# EAGLE design stereo amp 1562Q (EAGLE 5.07)
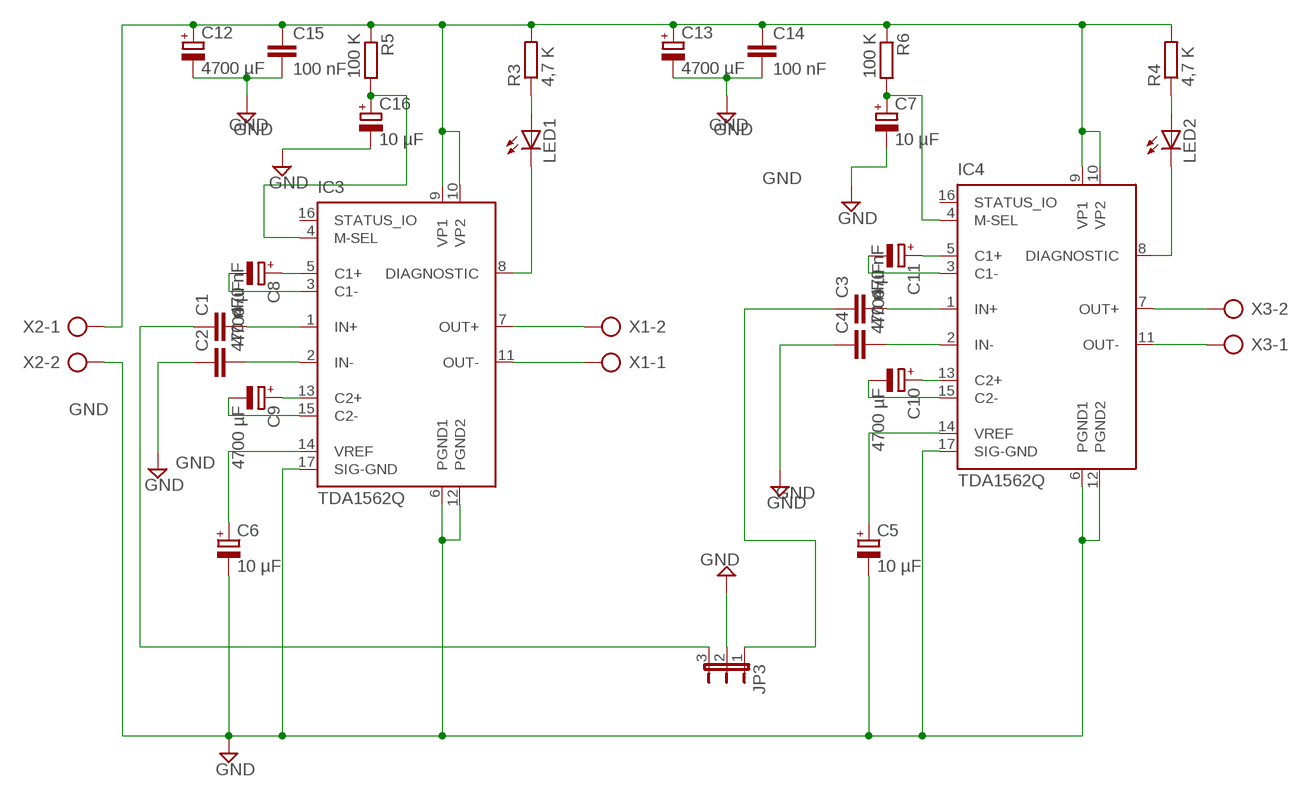
[diagram p0: schematic, sheet 1]

## Parts
C1  470 nF  C5/5  [C5B5]
C2  470 nF  C5/5  [C5B5]
C3  470 nF  C5/5  [C5B5]
C4  470 nF  C5/5  [C5B5]
C5  10 µF  CPOL-EUE2.5-6  [E2,5-6]
C6  10 µF  CPOL-EUE2.5-6  [E2,5-6]
C7  10 µF  CPOL-EUE2.5-6  [E2,5-6]
C8  4700 µF  CPOL-EUE7.5-18  [E7,5-18]
C9  4700 µF  CPOL-EUE7.5-18  [E7,5-18]
C10  4700 µF  CPOL-EUE7.5-18  [E7,5-18]
C11  4700 µF  CPOL-EUE7.5-18  [E7,5-18]
C12  4700 µF  CPOL-EUE7.5-18  [E7,5-18]
C13  4700 µF  CPOL-EUE7.5-18  [E7,5-18]
C14  100 nF  C-EU050-030X075  [C050-030X075]
C15  100 nF  C-EU050-030X075  [C050-030X075]
C16  10 µF  CPOL-EUE2.5-6  [E2,5-6]
IC3  TDA1562Q  [MULTIWAT-SIL17]
IC4  TDA1562Q  [MULTIWAT-SIL17]
JP3  JP2E  [JP2]
LED1  LED3MM  [LED3MM]
LED2  LED3MM  [LED3MM]
R3  4,7 K  R-EU_0204/7  [0204/7]
R4  4,7 K  R-EU_0204/7  [0204/7]
R5  100 K  R-EU_0204/7  [0204/7]
R6  100 K  R-EU_0204/7  [0204/7]
X1  AK300/2  [AK300/2]
X2  AK300/2  [AK300/2]
X3  AK300/2  [AK300/2]

## Nets
GND: C2.1 C4.1 C5.- C6.- C7.- C12.- C13.- C14.2 C15.2 C16.- IC3.6(PGND1) IC3.12(PGND2) IC3.17(SIG-GND) IC4.6(PGND1) IC4.12(PGND2) IC4.17(SIG-GND) JP3.2 X2.2
N$1: C8.+ IC3.5(C1+)
N$2: C10.+ IC4.13(C2+)
N$3: C11.+ IC4.5(C1+)
N$4: C9.+ IC3.13(C2+)
N$5: C3.2 IC4.1(IN+)
N$6: LED1.A R3.1
N$7: C8.- IC3.3(C1-)
N$8: C9.- IC3.15(C2-)
N$9: LED2.A R4.1
N$10: IC3.7(OUT+) X1.2
N$11: C1.2 IC3.1(IN+)
N$12: C2.2 IC3.2(IN-)
N$13: C4.2 IC4.2(IN-)
N$14: C6.+ IC3.14(VREF)
N$15: C7.+ IC4.4(M-SEL) R6.2
N$16: C11.- IC4.3(C1-)
N$17: C3.1 JP3.1
N$18: C10.- IC4.15(C2-)
N$20: IC4.8(DIAGNOSTIC) LED2.K(C)
N$22: IC3.11(OUT-) X1.1
N$23: IC4.11(OUT-) X3.1
N$24: IC3.8(DIAGNOSTIC) LED1.K(C)
N$25: C1.1 JP3.3
N$26: C5.+ IC4.14(VREF)
N$27: IC4.7(OUT+) X3.2
N$30: C16.+ IC3.4(M-SEL) R5.2
N$32: C12.+ C13.+ C14.1 C15.1 IC3.9(VP1) IC3.10(VP2) IC4.9(VP1) IC4.10(VP2) R3.2 R4.2 R5.1 R6.1 X2.1
Unconnected: IC3.16(STATUS_IO) IC4.16(STATUS_IO)

## Library data of the parts
C1-C4 = capacitor-wima:C: CAPACITOR naming: grid - package width
C5-C13 C16 = rcl:CPOL-EU: POLARIZED CAPACITOR, European symbol
C14 C15 = rcl:C-EU: CAPACITOR, European symbol
IC3 IC4 = linear:TDA1562: 70 W High Efficiency Power Amplifier with diagnostic facility
JP3 = jumper:JP2E: JUMPER
LED1 LED2 = led:LED: LED OSRAM: - CHIPLED LG R971, LG N971, LY N971, LG Q971, LY Q971, LO R971, LY R971 LH N974, LH R974 LS Q976, LO Q976, LY Q976 LO Q996 - Hyper CHIPLED LW Q18S LB Q993, LB Q99A, LB R99A - SideLED LS A670, LO A670, LY A670, LG A670, LP A670 LB A673, LV A673, LT A673, LW A673 LH A674 LY A675 LS A676, LA A676, LO A676, LY A676, LW A676 LS A679, LY A679, LG A679 - Hyper Micro SIDELED® LS Y876, LA Y876, LO Y876, LY Y876 LT Y87S - SmartLED LW L88C, LW L88S LB L89C, LB L89S, LG L890 LS L89K, LO L89K, LY L89K LS L896, LA L896, LO L896, LY L896 - TOPLED LS T670, LO T670, LY T670, LG T670, LP T670 LSG T670, LSP T670, LSY T670, LOP T670, LYG T670 LG T671, LOG T671, LSG T671 LB T673, LV T673, LT T673, LW T673 LH T674 LS T676, LA T676, LO T676, LY T676, LB T676, LH T676, LSB T676, LW T676 LB T67C, LV T67C, LT T67C, LS T67K, LO T67K, LY T67K, LW E67C LS E67B, LA E67B, LO E67B, LY E67B, LB E67C, LV E67C, LT E67C LW T67C LS T679, LY T679, LG T679 LS T770, LO T770, LY T770, LG T770, LP T770 LB T773, LV T773, LT T773, LW T773 LH T774 LS E675, LA E675, LY E675, LS T675 LS T776, LA T776, LO T776, LY T776, LB T776 LHGB T686 LT T68C, LB T68C - Hyper Mini TOPLED® LB M676 - Mini TOPLED Santana® LG M470 LS M47K, LO M47K, LY M47K Source: http://www.osram.convergy.de LUXEON: - LUMILED® LXK2-PW12-R00, LXK2-PW12-S00, LXK2-PW14-U00, LXK2-PW14-V00 LXK2-PM12-R00, LXK2-PM12-S00, LXK2-PM14-U00 LXK2-PE12-Q00, LXK2-PE12-R00, LXK2-PE12-S00, LXK2-PE14-T00, LXK2-PE14-U00 LXK2-PB12-K00, LXK2-PB12-L00, LXK2-PB12-M00, LXK2-PB14-N00, LXK2-PB14-P00, LXK2-PB14-Q00 LXK2-PR12-L00, LXK2-PR12-M00, LXK2-PR14-Q00, LXK2-PR14-R00 LXK2-PD12-Q00, LXK2-PD12-R00, LXK2-PD12-S00 LXK2-PH12-R00, LXK2-PH12-S00 LXK2-PL12-P00, LXK2-PL12-Q00, LXK2-PL12-R00 Source: www.luxeon.com KINGBRIGHT: KA-3528ASYC Source: www.kingbright.com
R3-R6 = rcl:R-EU_: RESISTOR, European symbol
X1-X3 = con-ptr500:AK300/2: CONNECTOR

## Board
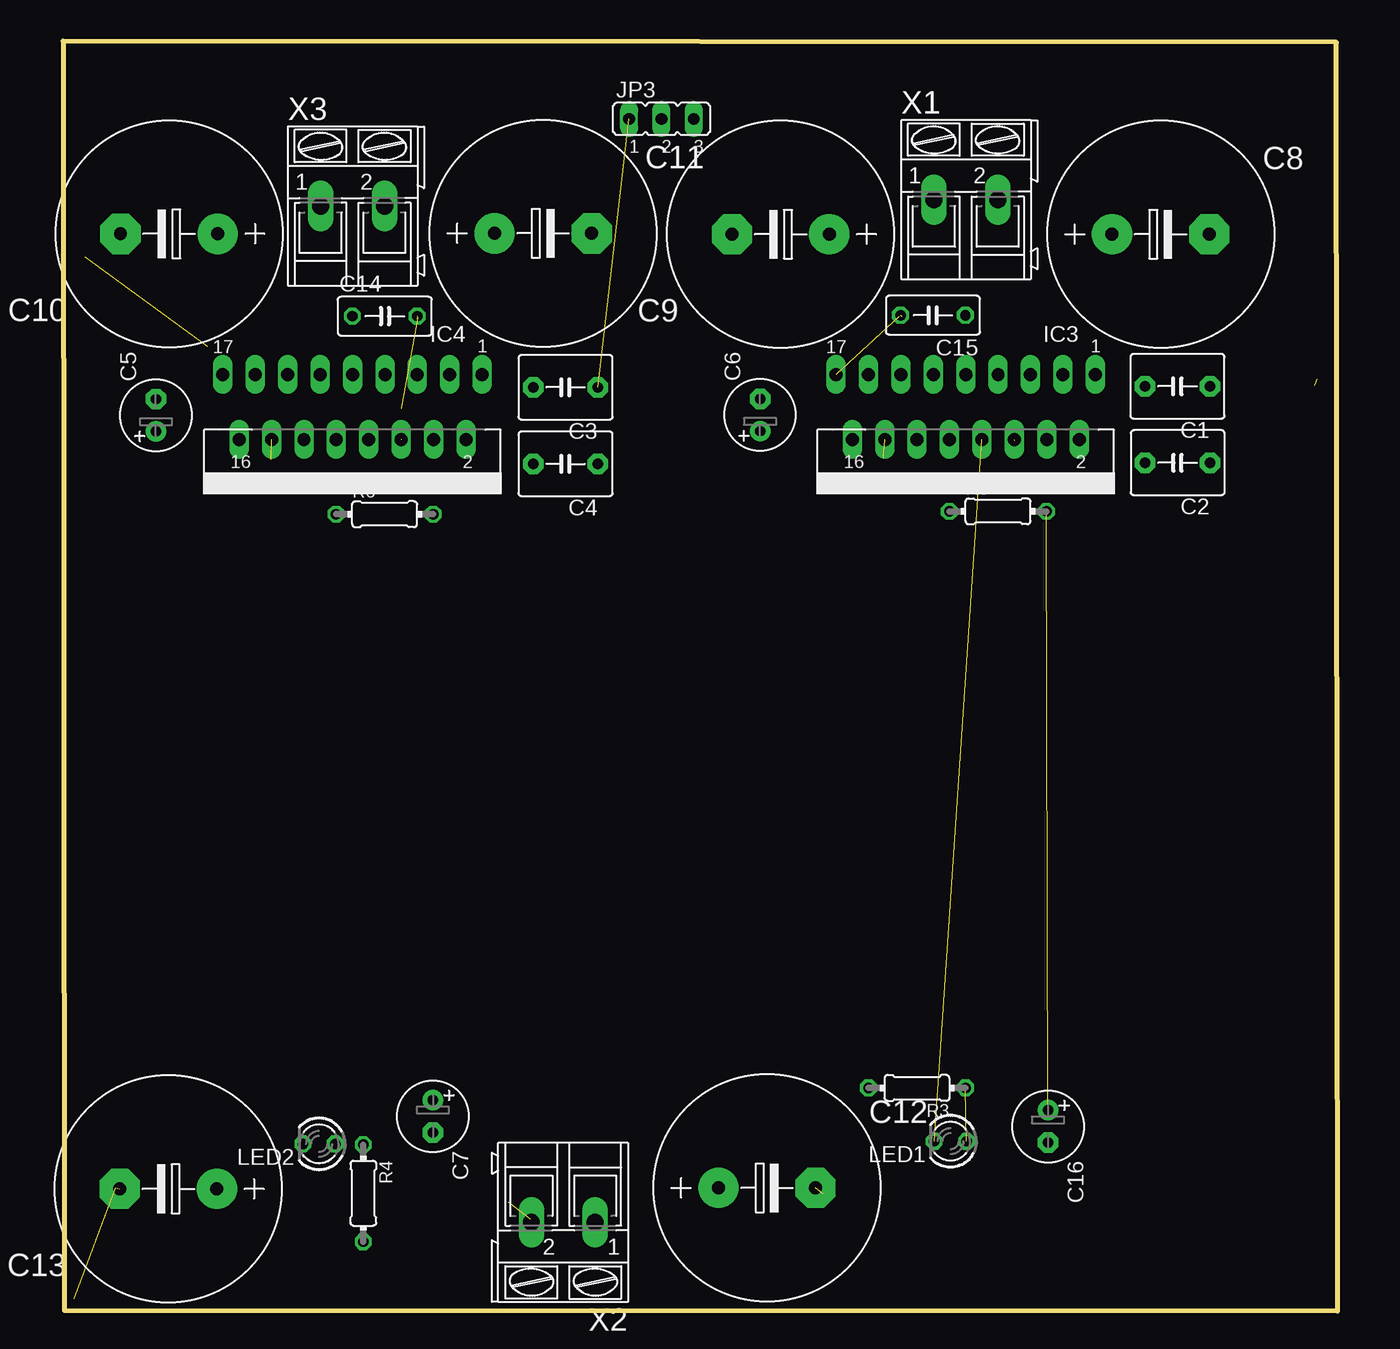
[diagram p1: board, top side]
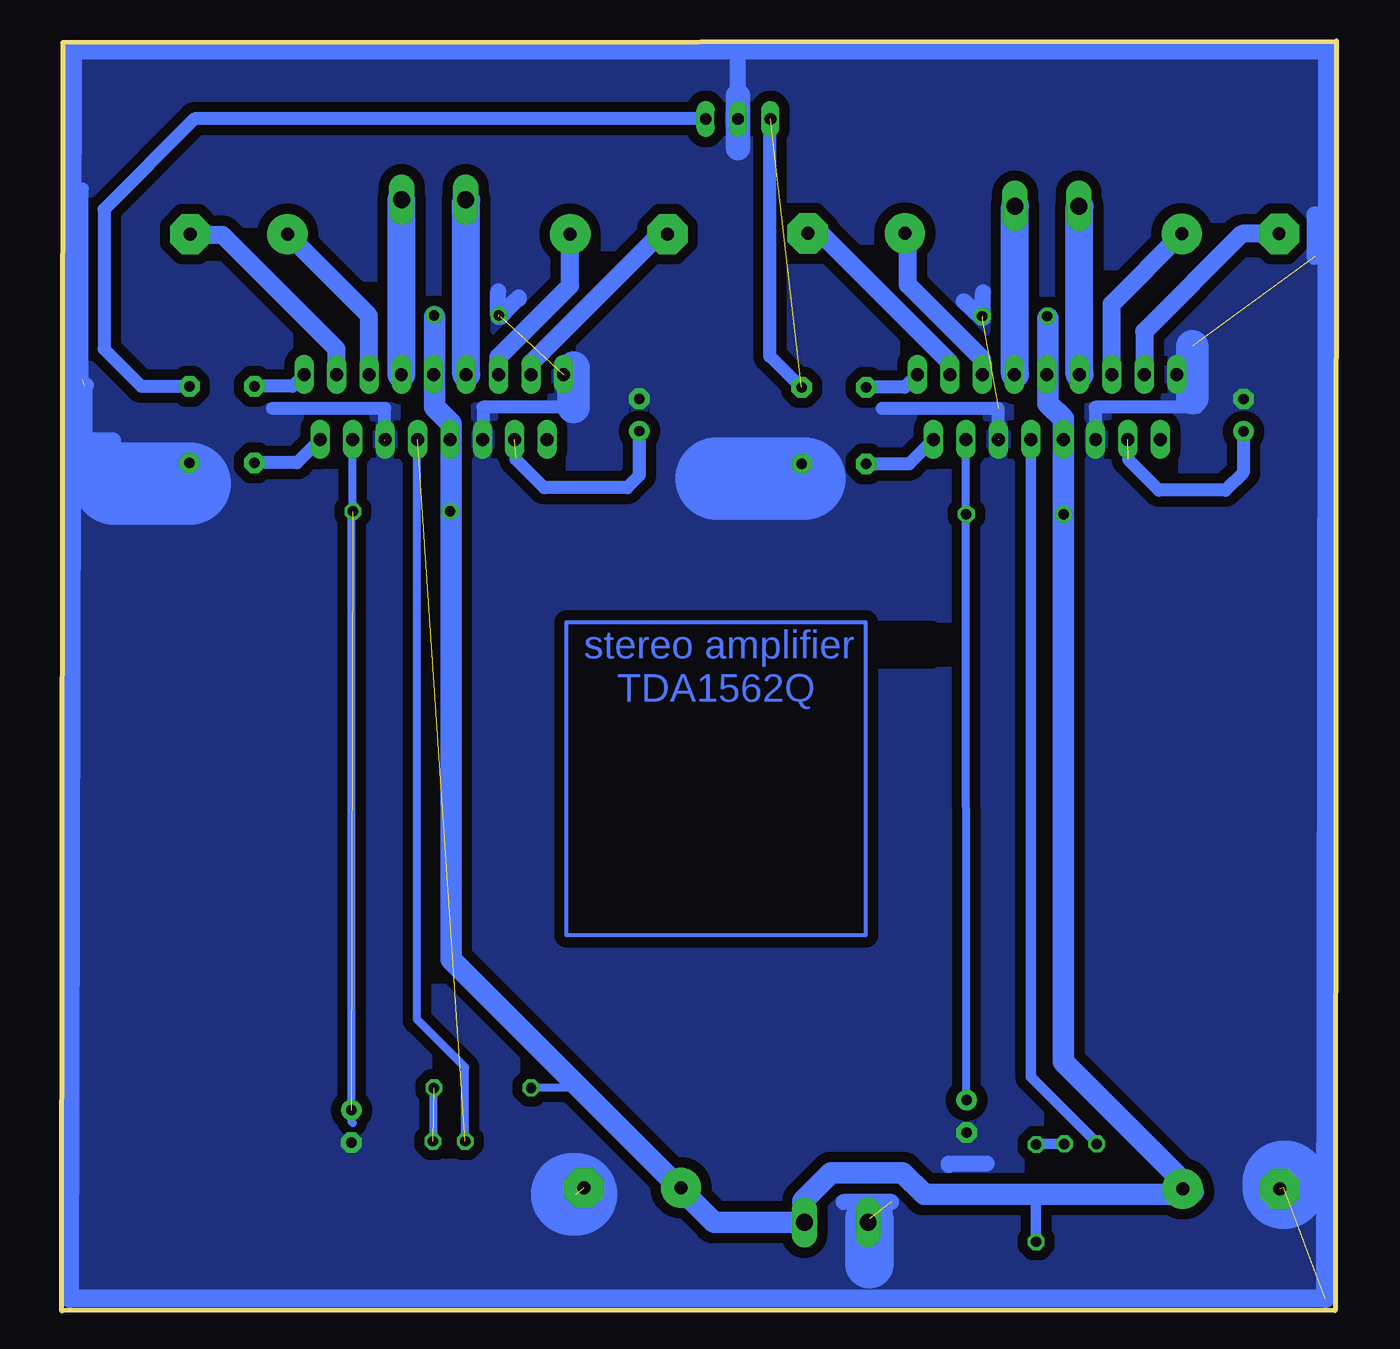
[diagram p2: board, bottom side, seen from below]

Size 99.9 x 99.54 mm. Coordinates in mm from the lower left corner, seen from the top.
Outline: 0.1,0.04 99.9,0 99.8,99.44 0,99.54 0.1,0.04
Copper layers (1*16): Top 0.035mm / dielectric 1.5mm / Bottom 0.035mm
Design rules "default": minimum track width 10mil, minimum drill 24mil, track to track 8mil, track to pad 8mil, pad to pad 8mil, via to via 8mil, smd to smd 8mil, copper to edge 40mil, drill to drill 8mil, minimum pad ring 10mil, minimum via ring 8mil, stop-mask expansion 4mil, vias tented up to drill 0mil, thermal gap 10mil

### Footprints (pad centres in the part's own frame; a part is rotated, then mirrored left to right if it is on the bottom)
C5B5 = drill 0.813 pad 1.6 octagon: 1 -2.54,0; 2 2.54,0
E2,5-6 = drill 0.813 pad 1.6 round: + -1.27,0 | drill 0.813 pad 1.6 octagon: - 1.27,0
E7,5-18 = drill 1.016 pad 3.15 round: + -3.81,0 | drill 1.016 pad 3.15 octagon: - 3.81,0
C050-030X075 = drill 0.813 octagon: 1 -2.54,0; 2 2.54,0
MULTIWAT-SIL17 = drill 1.016 long: 1 -10.16,-7.62; 2 -8.89,-2.54; 3 -7.62,-7.62; 4 -6.35,-2.54; 5 -5.08,-7.62; 6 -3.81,-2.54; 7 -2.54,-7.62; 8 -1.27,-2.54; 9 0,-7.62; 10 1.27,-2.54; 11 2.54,-7.62; 12 3.81,-2.54; 13 5.08,-7.62; 14 6.35,-2.54; 15 7.62,-7.62; 16 8.89,-2.54; 17 10.16,-7.62
JP2 = drill 0.914 long: 1 -2.54,0; 2 0,0; 3 2.54,0
LED3MM = drill 0.813 octagon: A -1.27,0; K 1.27,0
0204/7 = drill 0.813 octagon: 1 -3.81,0; 2 3.81,0
AK300/2 = drill 1.321 long: 1 -2.515,0; 2 2.489,0

### Placement (x,y rotation side)
C1  87.35,72.48 180 top
C2  87.36,66.49 180 top
C3  39.38,72.4 180 top
C4  39.38,66.4 180 top
C5  7.27,70.21 90 top
C6  54.63,70.24 90 top
C7  28.98,15.25 270 top
C8  86.03,84.4 0 top
C9  56.24,84.4 180 top
C10  8.3,84.43 180 top
C11  37.62,84.47 0 top
C12  55.17,9.64 0 top
C13  8.24,9.57 180 top
C14  25.21,77.98 0 top
C15  68.18,78.05 180 top
C16  77.2,14.46 270 top
IC3  70.75,65.78 180 top
IC4  22.68,65.78 180 top
JP3  46.9,93.44 0 top
LED1  69.55,13.3 180 top
LED2  20.06,13.09 180 top
R3  66.93,17.48 180 top
R4  23.53,9.23 270 top
R5  73.28,62.68 0 top
R6  25.2,62.45 0 top
X1  70.77,87.11 0 top
X2  39.19,6.94 180 top
X3  22.7,86.61 0 top

### Tracks (layer width: path | path; a pad name or v marks a point on that pad's centre or on a via)
GND  (14 unrouted)
  Bottom 1: C4.1 43.98,66.4 | C2.1 92.11,66.49
  Bottom 1.016: 18.9,68.34 18.9,70.84 10.9,70.84 | 26.5,68.34 26.5,70.74 35.6,70.74 | 66.9,68.24 66.9,70.84 59.8,70.84 59.3,70.84 | 74.6,68.24 74.6,70.74 83.4,70.74 | 98.3,73.04 98.3,87.94
  Bottom 1.27: 27.8,77.84 29.2,79.14 | 27.7,77.84 27.7,79.84 | 65.7,79.94 65.7,78.04 64.1,79.34 | 65.7,77.94 64.1,79.44 65.5,77.94 | 98,72.54 98.1,72.54 98.1,68.24 | 98.1,68.24 98.1,65.84 | 1.7,82.64 1.7,85.94 | 95.9,68.24 98.1,68.24 | JP3.2 46.9,95.24 46.9,98.64 | 27.4,11.54 30.4,11.54 30.4,11.44 | 34.89,8.54 38.6,8.54
  Bottom 1.422: 0.8,98.84 99,98.84 99.25,0.95 0.85,0.95 0.7,98.84
  Bottom 1.93: 46.9,91.14 46.9,95.24
  Bottom 2.54: 59.8,70.84 59.8,73.94 | 11.3,71.54 11.3,75.64
  Bottom 3.81: 36.6,3.64 36.6,7.24
  Bottom 6.452: 59.9,9.14 59.6,9.14 | 4,10.14 4.1,10.14 4.1,9.64 | 41.7,65.24 48.6,65.24 | 89.9,64.84 95.8,64.84
  pour Bottom (isolate 0.813): -0.5,99.74 100,99.74 100.34,-0.14 -0.1,-0.26
N$1
  Bottom 1.422: IC3.5 75.83,78.01 C8.+
N$2
  Bottom 1.422: IC4.13 17.6,78.94 C10.+
N$3
  Bottom 1.422: IC4.5 27.76,74.6 33.6,80.44 33.6,84.26 C11.+
N$4
  Bottom 1.422: C9.+ 60.05,80.39 65.67,74.77 IC3.13
N$5
  Bottom 1: C3.2 33.84,72.4 IC4.1
N$6  (1 unrouted)
N$7
  Bottom 1.422: IC3.3 78.37,75.41 87.3,84.34 89.78,84.34 C8.-
N$8
  Bottom 1.422: IC3.15 63.13,74.31 53.3,84.14 52.69,84.14 C9.-
N$9
  Bottom 0.813: LED2.A 23.53,13.09 R4.1
N$10
  Bottom 1.422: 73.29,87.08 X1.2
  Bottom 2.184: IC3.7 73.29,87.08
N$11
  Bottom 1: C1.2 81.83,72.48 IC3.1
N$12
  Bottom 1: C2.2 81.47,66.49 IC3.2
N$13
  Bottom 1: C4.2 33.49,66.4 IC4.2
N$14  (1 unrouted)
  Bottom 1.016: C6.+ 54.63,65.51 55.6,64.54 62.1,64.54 64.3,66.74 64.3,66.84
N$15
  Bottom 0.61: IC4.4 29.03,62.63 R6.2 C7.+
N$16
  Bottom 1.422: IC4.3 30.3,74.34 40.6,84.64 41.26,84.64 C11.-
N$17  (1 unrouted)
N$18
  Bottom 1.422: IC4.15 15.06,76.78 7.4,84.44 C10.-
N$20
  Bottom 0.813: LED2.K 18.79,13.18 23.96,18.35 IC4.8
N$21
  Bottom 0.305: 36.88,53.98 60.35,53.98 60.35,29.44 36.88,29.44 36.88,53.98
N$22
  Bottom 1.422: 68.21,87.06 X1.1
  Bottom 2.184: IC3.11 68.21,87.06
N$23
  Bottom 1.422: 20.14,86.56 X3.1
  Bottom 2.184: IC4.11 20.14,86.56
N$24  (1 unrouted)
N$25
  Bottom 1: 93.68,72.48 C1.1
  Bottom 1.016: JP3.3 89.5,93.44 96.6,86.34 96.6,75.4 93.68,72.48
N$26  (1 unrouted)
  Bottom 1.016: C5.+ 7.27,65.77 8.7,64.34 13.9,64.34 16.3,66.74
N$27
  Bottom 1.422: IC4.7 25.19,73.43
  Bottom 2.184: 25.19,73.43 X3.2
N$30  (1 unrouted)
  Bottom 0.61: R5.2 77.1,62.84 IC3.4
N$32
  Bottom 0.61: R5.1 69.48,62.84 | R3.2 58.94,17.48 57.66,15.88
  Bottom 0.813: R4.2 23.56,5.42 23.56,9.14
  Bottom 1: R6.1 21.41,62.63 | C13.+ 11.56,9.57
  Bottom 1.422: 21.41,62.63 IC4.10 21.41,69.95 22.6,71.14 22.68,71.22 IC4.9 22.68,76.1 C14.1 | 69.48,62.84 IC3.10 69.58,69.92 70.7,70.84 70.7,73.35 IC3.9 70.72,73.43 C15.1 | 51.73,9.96 52.09,10.27 | 51.73,9.96 C12.+ | R6.1 21.39,19.4 11.56,9.57 | R5.1 69.47,27.7 57.66,15.88 51.73,9.96 | X2.1 41.8,6.94 48.71,6.94 51.73,9.96
  Bottom 1.676: 70.7,77.94 70.7,70.84 69.4,69.54 69.4,27.54 48.8,6.94 41.8,6.94 | 41.8,6.94 41.8,6.84 | 41.8,6.94 41.8,8.64 39.6,10.84 34,10.84 32.3,9.14 23.56,9.14 11.4,9.14 11.2,9.34 21.4,19.54 21.4,69.94 22.6,71.14 22.6,77.84 | 41.8,6.94 41.7,6.84 41.5,7.04 41.5,6.94
N$33
  Bottom 1.016: 42,72.44 44.4,74.84 44.4,93.34 44.5,93.24
N$36
  Bottom 0.61: 77.2,62.74 77.2,14.84 77.1,14.74
N$38
  Bottom 0.61: 70.76,13.26 70.76,17.47
N$39
  Bottom 0.61: 72.1,68.31 72.05,68.31 72.05,22.78 71.98,22.78 68.29,19.09 68.29,13.3 68.28,13.29 68.18,13.29 68.15,13.26

### Text on the board
Bottom: stereo amplifier | TDA1562Q